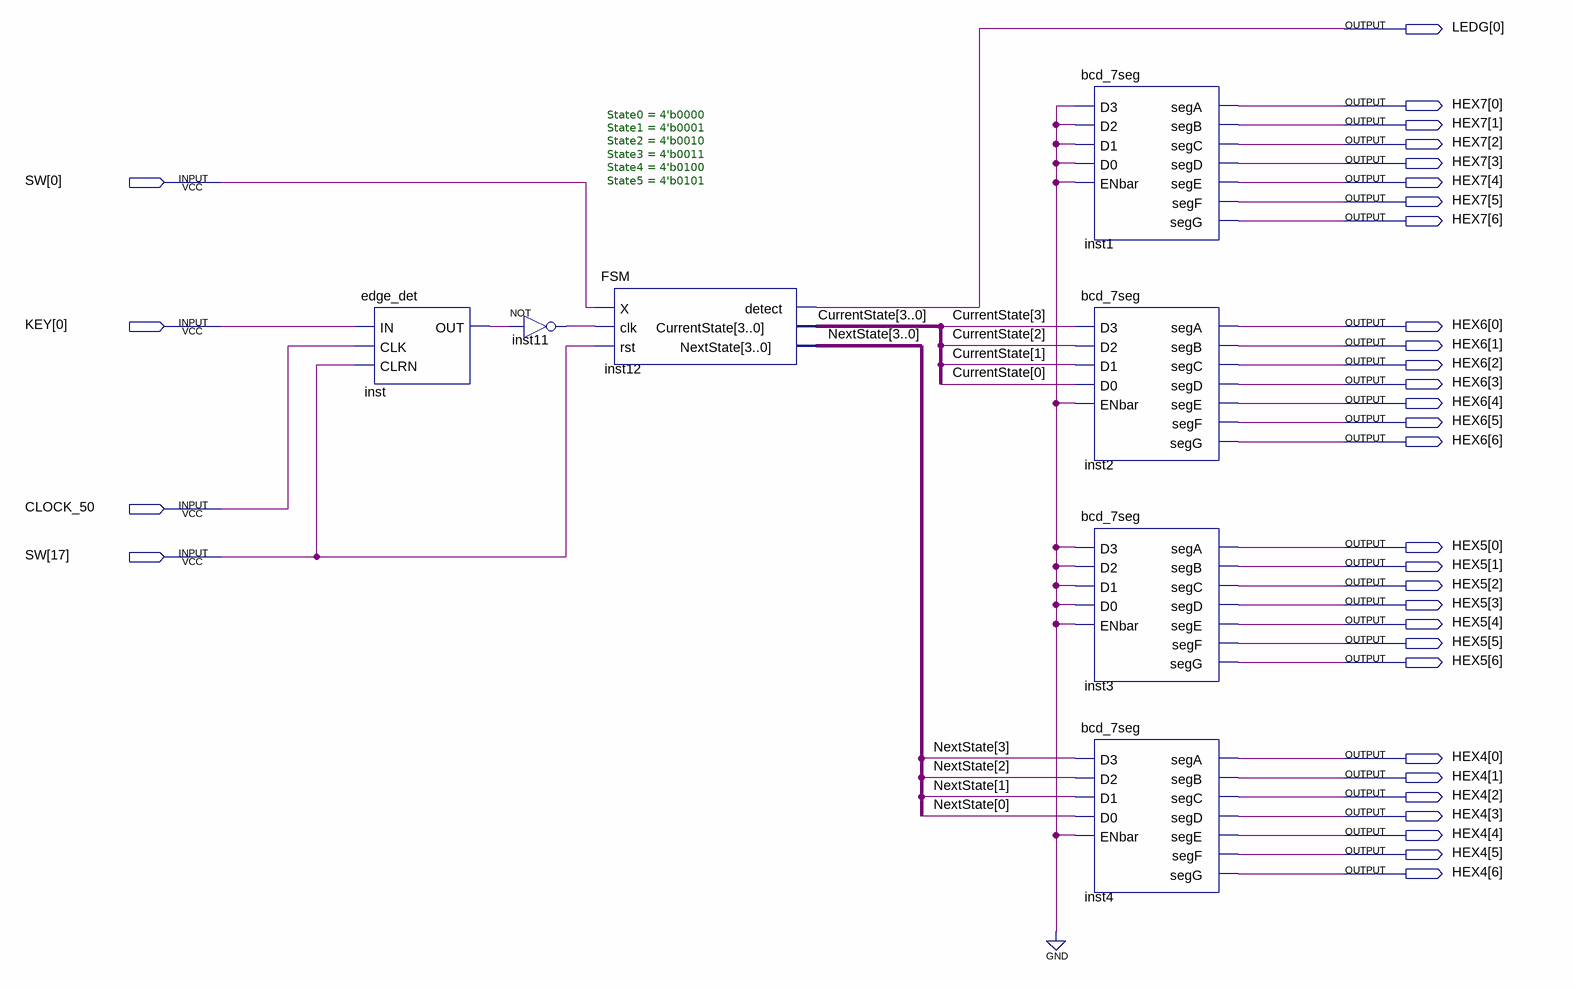
[diagram p0: schematic sheet]
// Quartus schematic Lab7_top_level.bdf as structural Verilog: 7 symbols, 33 pins
module Lab7_top_level (
  input  [17:0] SW,
  input  [0:0] KEY,
  input  CLOCK_50,
  output [0:0] LEDG,
  output [6:0] HEX7,
  output [6:0] HEX6,
  output [6:0] HEX5,
  output [6:0] HEX4
);

  wire inst11_out, inst_out;
  wire [3:0] CurrentState, NextState;

  edge_det inst (.IN(KEY[0]), .CLK(CLOCK_50), .CLRN(SW[17]), .OUT(inst_out));
  not inst11 (inst11_out, inst_out);
  FSM #(.State0(4'b0000), .State1(4'b0001), .State2(4'b0010), .State3(4'b0011), .State4(4'b0100), .State5(4'b0101)) inst12 (
    .X(SW[0]), .clk(inst11_out), .rst(SW[17]), .detect(LEDG[0]), .CurrentState(CurrentState),
    .NextState(NextState));
  bcd_7seg inst1 (
    .D3(1'b0), .D2(1'b0), .D1(1'b0), .D0(1'b0), .ENbar(1'b0), .segA(HEX7[0]), .segB(HEX7[1]), .segC(HEX7[2]),
    .segD(HEX7[3]), .segE(HEX7[4]), .segF(HEX7[5]), .segG(HEX7[6]));
  bcd_7seg inst2 (
    .D3(CurrentState[3]), .D2(CurrentState[2]), .D1(CurrentState[1]), .D0(CurrentState[0]), .ENbar(1'b0),
    .segA(HEX6[0]), .segB(HEX6[1]), .segC(HEX6[2]), .segD(HEX6[3]), .segE(HEX6[4]), .segF(HEX6[5]),
    .segG(HEX6[6]));
  bcd_7seg inst3 (
    .D3(1'b0), .D2(1'b0), .D1(1'b0), .D0(1'b0), .ENbar(1'b0), .segA(HEX5[0]), .segB(HEX5[1]), .segC(HEX5[2]),
    .segD(HEX5[3]), .segE(HEX5[4]), .segF(HEX5[5]), .segG(HEX5[6]));
  bcd_7seg inst4 (
    .D3(NextState[3]), .D2(NextState[2]), .D1(NextState[1]), .D0(NextState[0]), .ENbar(1'b0), .segA(HEX4[0]),
    .segB(HEX4[1]), .segC(HEX4[2]), .segD(HEX4[3]), .segE(HEX4[4]), .segF(HEX4[5]), .segG(HEX4[6]));
endmodule
